# EAGLE design avr_servo (EAGLE 5.11)
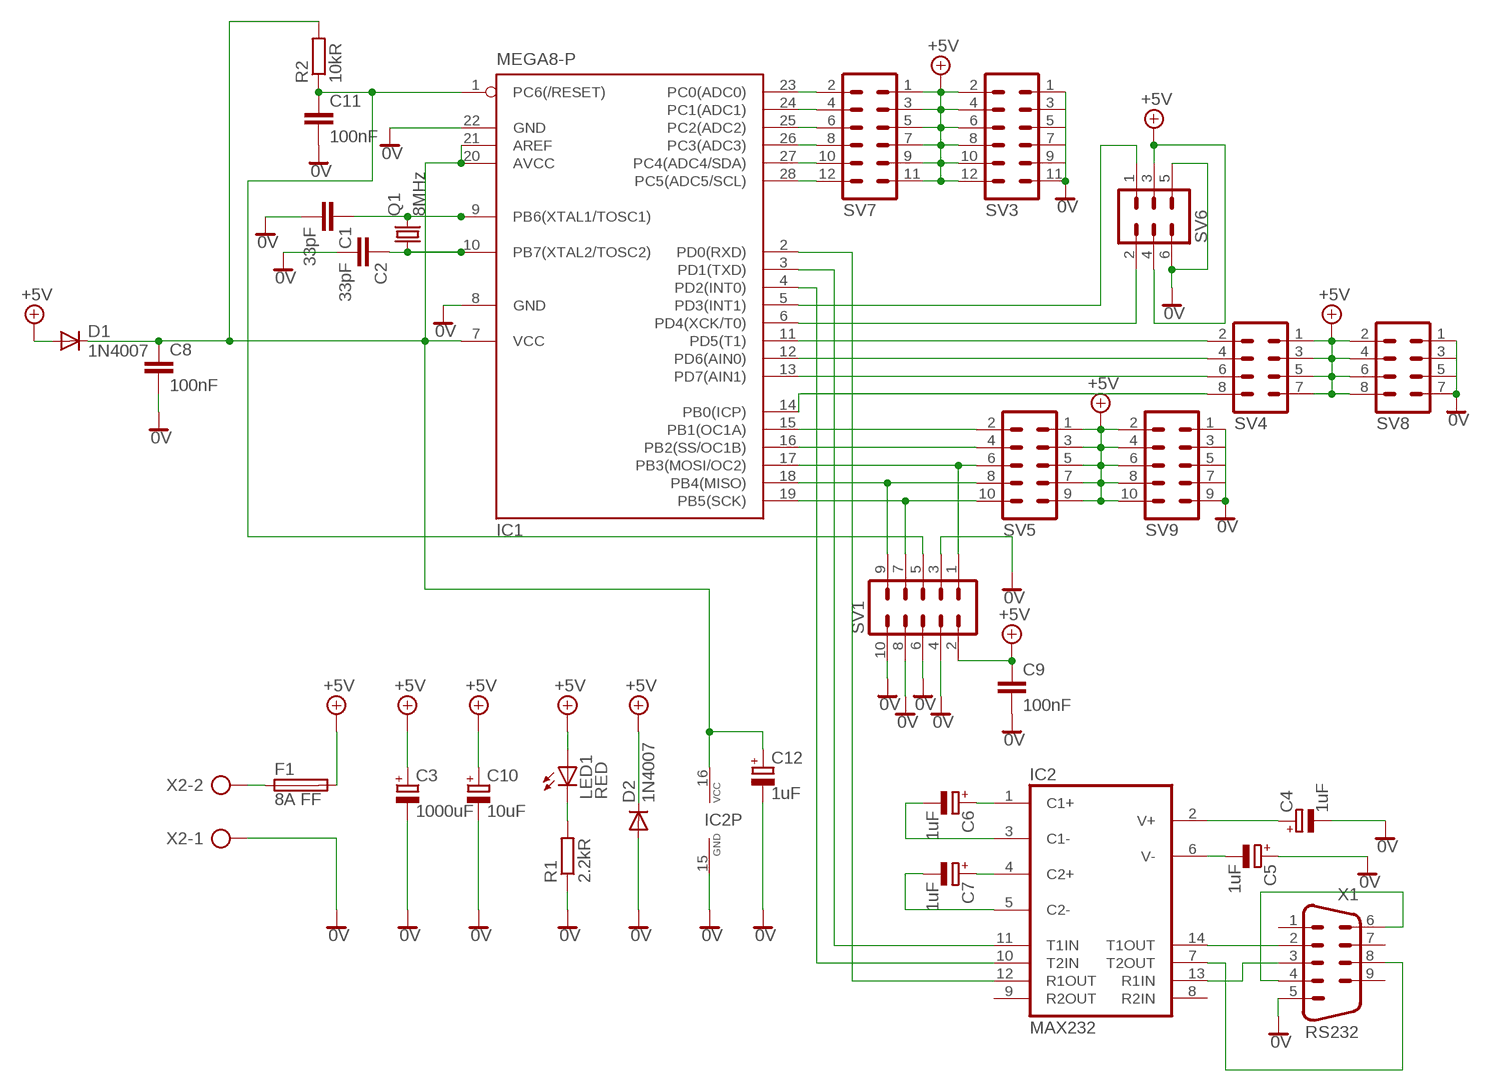
[diagram p0: schematic, sheet 1]

## Parts
C1  33pF  C-EU050-024X044  [C050-024X044]
C2  33pF  C-EU050-024X044  [C050-024X044]
C3  1000uF  CPOL-EUE3.5-10  [E3,5-10]
C4  1uF  CPOL-EUE2.5-5  [E2,5-5]
C5  1uF  CPOL-EUE2.5-5  [E2,5-5]
C6  1uF  CPOL-EUE2.5-5  [E2,5-5]
C7  1uF  CPOL-EUE2.5-5  [E2,5-5]
C8  100nF  C-EU050-025X075  [C050-025X075]
C9  100nF  C-EU050-025X075  [C050-025X075]
C10  10uF  CPOL-EUE2.5-5  [E2,5-5]
C11  100nF  C-EU050-025X075  [C050-025X075]
C12  1uF  CPOL-EUE2.5-5  [E2,5-5]
D1  1N4007  1N4446  [DO35-10]
D2  1N4007  1N4446  [DO35-10]
F1  8A FF  FUSESH22,5A  [SH22,5A]
IC1  MEGA8-P  [DIL28-3]
IC2  MAX232  [DIL16]
LED1  RED  LED5MM  [LED5MM]
Q1  8MHz  CRYSTALHC49S  [HC49/S]
R1  2.2kR  R-EU_0204/7  [0204/7]
R2  10kR  R-EU_0204/7  [0204/7]
SV1  ML10  [ML10]
SV3  MA06-2  [MA06-2]
SV4  MA04-2  [MA04-2]
SV5  MA05-2  [MA05-2]
SV6  MA03-2  [MA03-2]
SV7  MA06-2  [MA06-2]
SV8  MA04-2  [MA04-2]
SV9  MA05-2  [MA05-2]
X1  RS232  M09HP  [M09HP]
X2  AK300/2  [AK300/2]

## Nets
0V: C1.2 C2.2 C3.- C4.- C5.+ C8.2 C9.2 C10.- C11.2 C12.- D2.A IC1.8(GND) IC1.22(GND) IC2.15(GND) R1.1 SV1.3 SV1.4 SV1.6 SV1.8 SV1.10 SV3.1 SV3.3 SV3.5 SV3.7 SV3.9 SV3.11 SV6.5 SV6.6 SV8.1 SV8.3 SV8.5 SV8.7 SV9.1 SV9.3 SV9.5 SV9.7 SV9.9 X1.5 X2.1
+5V: C3.+ C9.1 C10.+ D1.A D2.C F1.2 LED1.A SV1.2 SV3.2 SV3.4 SV3.6 SV3.8 SV3.10 SV3.12 SV4.1 SV4.3 SV4.5 SV4.7 SV5.1 SV5.3 SV5.5 SV5.7 SV5.9 SV6.3 SV6.4 SV7.1 SV7.3 SV7.5 SV7.7 SV7.9 SV7.11 SV8.2 SV8.4 SV8.6 SV8.8 SV9.2 SV9.4 SV9.6 SV9.8 SV9.10
N$1: IC2.14(T1OUT) X1.2
N$2: IC2.13(R1IN) X1.3
N$3: X1.4 X1.6
N$4: IC2.7(T2OUT) X1.8
N$5: C5.- IC2.6(V-)
N$6: C4.+ IC2.2(V+)
N$7: C6.+ IC2.1(C1+)
N$8: C7.+ IC2.4(C2+)
N$9: C6.- IC2.3(C1-)
N$10: C7.- IC2.5(C2-)
N$11: C8.1 C12.+ D1.C IC1.7(VCC) IC1.20(AVCC) IC1.21(AREF) IC2.16(VCC) R2.2
N$12: IC1.4(PD2(INT0)) IC2.10(T2IN)
N$13: C1.1 IC1.9(PB6(XTAL1/TOSC1)) Q1.2
N$14: C2.1 IC1.10(PB7(XTAL2/TOSC2)) Q1.1
N$15: F1.1 X2.2
N$17: C11.1 IC1.1(PC6(/RESET)) R2.1 SV1.5
N$18: IC1.5(PD3(INT1)) SV6.1
N$20: IC1.2(PD0(RXD)) IC2.12(R1OUT)
N$21: LED1.K(C) R1.2
N$22: IC1.3(PD1(TXD)) IC2.11(T1IN)
N$25: IC1.6(PD4(XCK/T0)) SV6.2
N$26: IC1.11(PD5(T1)) SV4.2
N$27: IC1.12(PD6(AIN0)) SV4.4
N$28: IC1.13(PD7(AIN1)) SV4.6
N$30: IC1.14(PB0(ICP)) SV4.8
N$31: IC1.15(PB1(OC1A)) SV5.2
N$32: IC1.16(PB2(SS/OC1B)) SV5.4
N$33: IC1.17(PB3(MOSI/OC2)) SV1.1 SV5.6
N$35: IC1.18(PB4(MISO)) SV1.9 SV5.8
N$36: IC1.19(PB5(SCK)) SV1.7 SV5.10
N$37: IC1.23(PC0(ADC0)) SV7.2
N$38: IC1.24(PC1(ADC1)) SV7.4
N$39: IC1.25(PC2(ADC2)) SV7.6
N$40: IC1.26(PC3(ADC3)) SV7.8
N$41: IC1.27(PC4(ADC4/SDA)) SV7.10
N$42: IC1.28(PC5(ADC5/SCL)) SV7.12
Unconnected: IC2.8(R2IN) IC2.9(R2OUT) X1.1 X1.7 X1.9

## Library data of the parts
C1 C2 C8 C9 C11 = rcl:C-EU: CAPACITOR, European symbol
C3-C7 C10 C12 = rcl:CPOL-EU: POLARIZED CAPACITOR, European symbol
D1 D2 = diode:1N4446: DIODE high speed (Philips)
F1 = fuse:FUSE: Fuse
IC1 = atmel:MEGA8-P: MICROCONTROLLER 8 Kbytes FLASH, 1 kbytes SRAM, 512 bytes EEPROM, USART, 4-channel 10 bit ADC, 2-channel 8 bit ADC Pin compatible with Atmega48, ATMega88, ATMega168 Source: avr.lbr; OC_FARNELL: unknown; OC_NEWARK: unknown
IC2 = maxim:MAX232: RS232 TRANSEIVER
LED1 = led:LED: LED OSRAM: - CHIPLED LG R971, LG N971, LY N971, LG Q971, LY Q971, LO R971, LY R971 LH N974, LH R974 LS Q976, LO Q976, LY Q976 LO Q996 - Hyper CHIPLED LW Q18S LB Q993, LB Q99A, LB R99A - SideLED LS A670, LO A670, LY A670, LG A670, LP A670 LB A673, LV A673, LT A673, LW A673 LH A674 LY A675 LS A676, LA A676, LO A676, LY A676, LW A676 LS A679, LY A679, LG A679 - Hyper Micro SIDELED® LS Y876, LA Y876, LO Y876, LY Y876 LT Y87S - SmartLED LW L88C, LW L88S LB L89C, LB L89S, LG L890 LS L89K, LO L89K, LY L89K LS L896, LA L896, LO L896, LY L896 - TOPLED LS T670, LO T670, LY T670, LG T670, LP T670 LSG T670, LSP T670, LSY T670, LOP T670, LYG T670 LG T671, LOG T671, LSG T671 LB T673, LV T673, LT T673, LW T673 LH T674 LS T676, LA T676, LO T676, LY T676, LB T676, LH T676, LSB T676, LW T676 LB T67C, LV T67C, LT T67C, LS T67K, LO T67K, LY T67K, LW E67C LS E67B, LA E67B, LO E67B, LY E67B, LB E67C, LV E67C, LT E67C LW T67C LS T679, LY T679, LG T679 LS T770, LO T770, LY T770, LG T770, LP T770 LB T773, LV T773, LT T773, LW T773 LH T774 LS E675, LA E675, LY E675, LS T675 LS T776, LA T776, LO T776, LY T776, LB T776 LHGB T686 LT T68C, LB T68C - Hyper Mini TOPLED® LB M676 - Mini TOPLED Santana® LG M470 LS M47K, LO M47K, LY M47K Source: http://www.osram.convergy.de LUXEON: - LUMILED® LXK2-PW12-R00, LXK2-PW12-S00, LXK2-PW14-U00, LXK2-PW14-V00 LXK2-PM12-R00, LXK2-PM12-S00, LXK2-PM14-U00 LXK2-PE12-Q00, LXK2-PE12-R00, LXK2-PE12-S00, LXK2-PE14-T00, LXK2-PE14-U00 LXK2-PB12-K00, LXK2-PB12-L00, LXK2-PB12-M00, LXK2-PB14-N00, LXK2-PB14-P00, LXK2-PB14-Q00 LXK2-PR12-L00, LXK2-PR12-M00, LXK2-PR14-Q00, LXK2-PR14-R00 LXK2-PD12-Q00, LXK2-PD12-R00, LXK2-PD12-S00 LXK2-PH12-R00, LXK2-PH12-S00 LXK2-PL12-P00, LXK2-PL12-Q00, LXK2-PL12-R00 Source: www.luxeon.com KINGBRIGHT: KA-3528ASYC Source: www.kingbright.com
Q1 = crystal:CRYSTAL: CRYSTAL
R1 R2 = rcl:R-EU_: RESISTOR, European symbol
SV1 = con-harting-ml:ML10: HARTING; OC_FARNELL: unknown; OC_NEWARK: unknown
SV3 SV7 = con-lstb:MA06-2: PIN HEADER; OC_FARNELL: unknown; OC_NEWARK: unknown
SV4 SV8 = con-lstb:MA04-2: PIN HEADER; OC_FARNELL: unknown; OC_NEWARK: unknown
SV5 SV9 = con-lstb:MA05-2: PIN HEADER; OC_FARNELL: unknown; OC_NEWARK: unknown
SV6 = con-lstb:MA03-2: PIN HEADER; OC_FARNELL: unknown; OC_NEWARK: unknown
X1 = con-subd:M09: SUB-D
X2 = con-ptr500:AK300/2: CONNECTOR

## Board
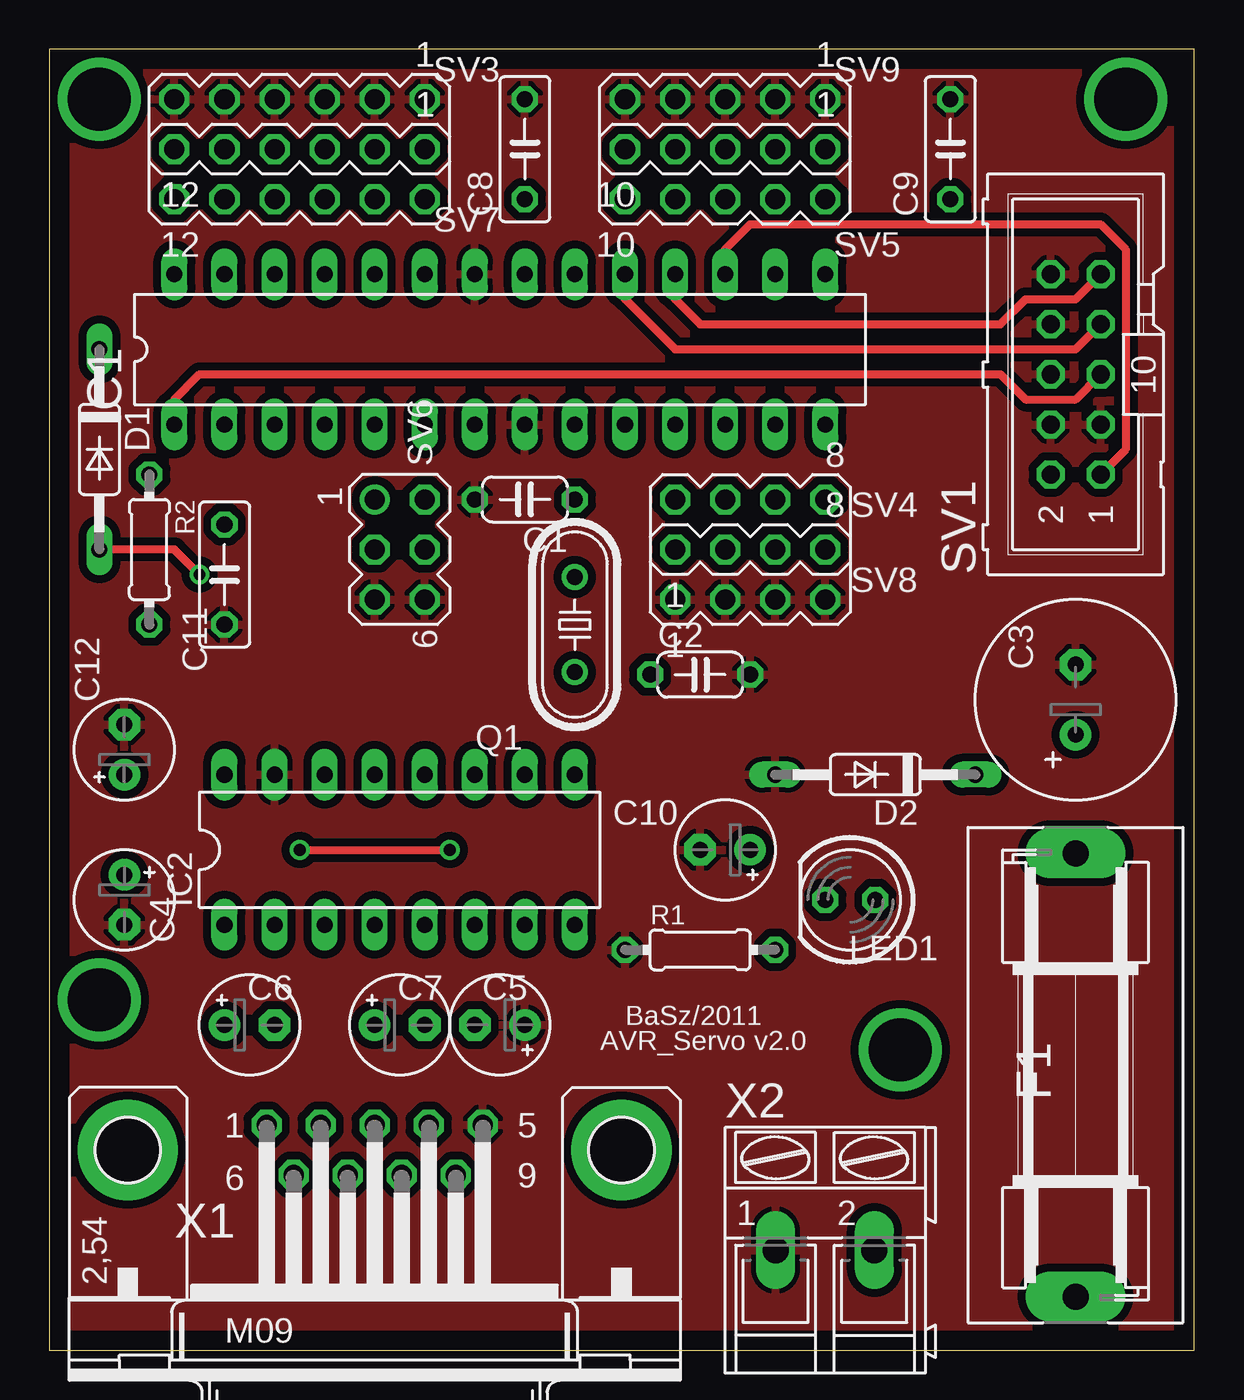
[diagram p1: board, top side]
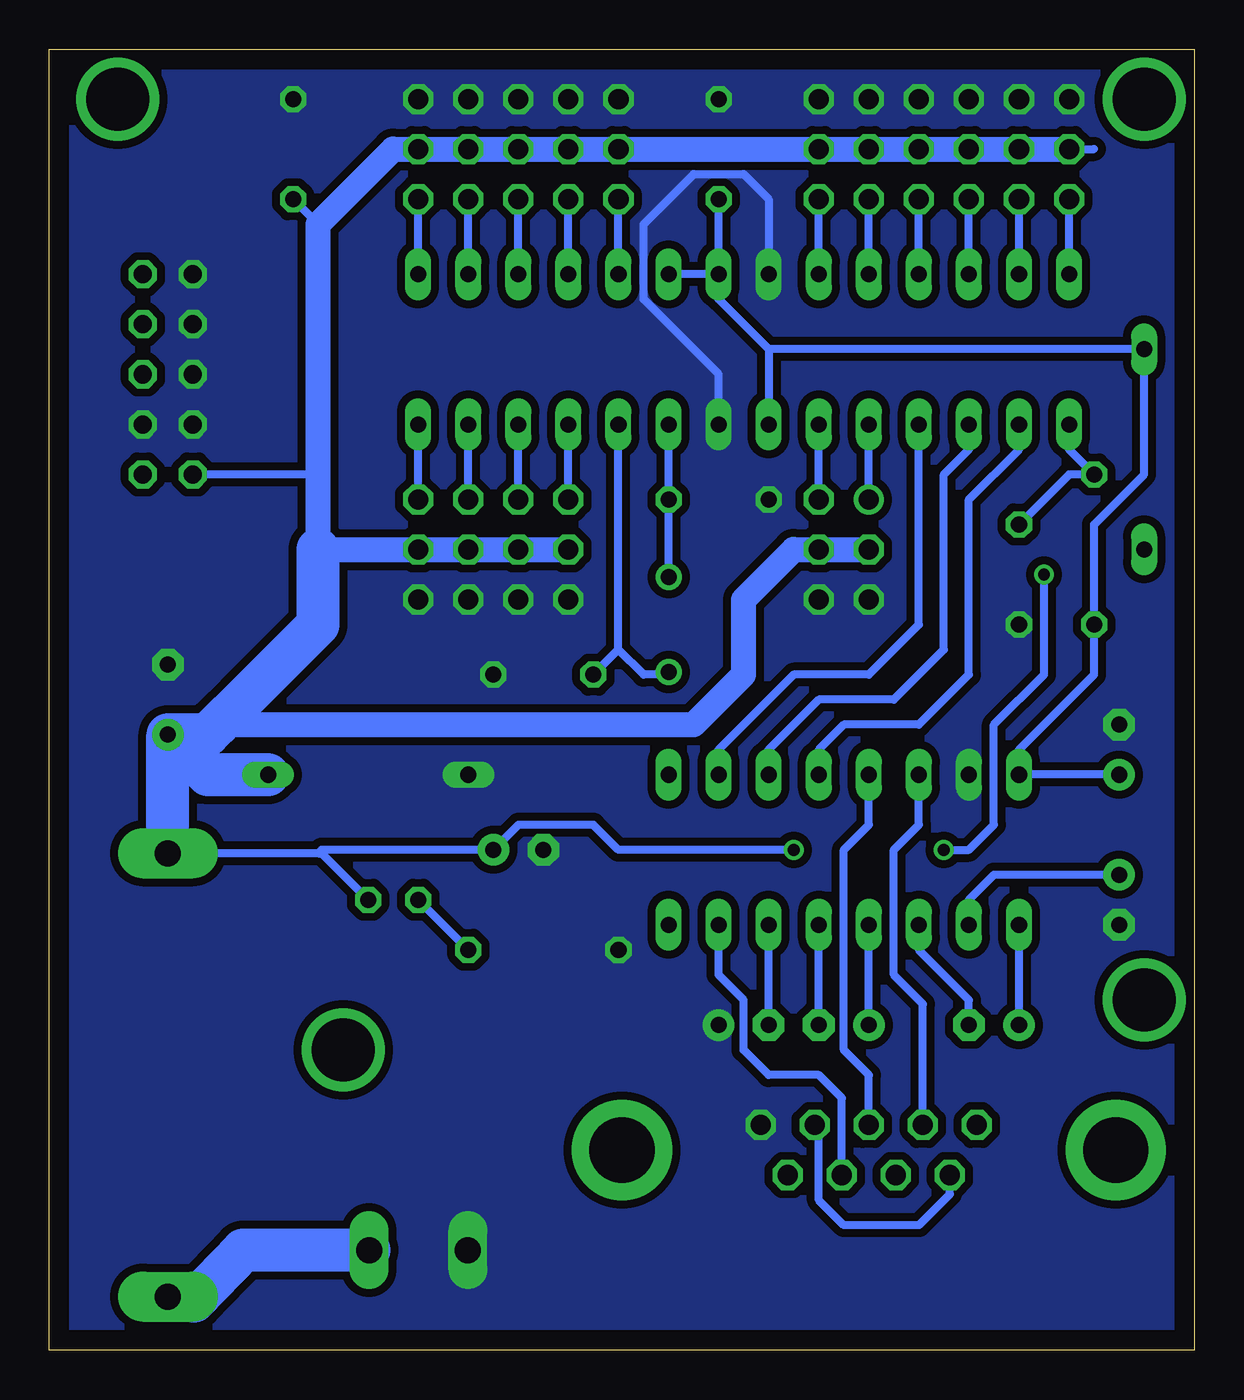
[diagram p2: board, bottom side, seen from below]

Size 58.09 x 66.03 mm. Coordinates in mm from the lower left corner, seen from the top.
Outline: 0,0 58.09,0 58.09,66.03 0,66.03 0,0
Copper layers (1*16): Top 0.035mm / dielectric 1.5mm / Bottom 0.035mm
Design rules "default": minimum track width 10mil, minimum drill 24mil, track to track 8mil, track to pad 8mil, pad to pad 8mil, via to via 8mil, smd to smd 8mil, copper to edge 40mil, drill to drill 8mil, minimum pad ring 10mil, minimum via ring 8mil, stop-mask expansion 4mil, vias tented up to drill 0mil, thermal gap 10mil

### Footprints (pad centres in the part's own frame; a part is rotated, then mirrored left to right if it is on the bottom)
C050-024X044 = drill 0.813 octagon: 1 -2.54,0; 2 2.54,0
E3,5-10 = drill 0.813 pad 1.6 round: + -1.778,0 | drill 0.813 pad 1.6 octagon: - 1.778,0
E2,5-5 = drill 0.813 pad 1.6 round: + -1.27,0 | drill 0.813 pad 1.6 octagon: - 1.27,0
C050-025X075 = drill 0.813 octagon: 1 -2.54,0; 2 2.54,0
DO35-10 = drill 0.813 long: A 5.08,0; C -5.08,0
SH22,5A = drill 1.321 pad 2.54 long: 1 -11.252,0; 2 11.252,0
DIL28-3 = drill 0.813 long: 1 -16.51,-3.81; 2 -13.97,-3.81; 3 -11.43,-3.81; 4 -8.89,-3.81; 5 -6.35,-3.81; 6 -3.81,-3.81; 7 -1.27,-3.81; 8 1.27,-3.81; 9 3.81,-3.81; 10 6.35,-3.81; 11 8.89,-3.81; 12 11.43,-3.81; 13 13.97,-3.81; 14 16.51,-3.81; 15 16.51,3.81; 16 13.97,3.81; 17 11.43,3.81; 18 8.89,3.81; 19 6.35,3.81; 20 3.81,3.81; 21 1.27,3.81; 22 -1.27,3.81; 23 -3.81,3.81; 24 -6.35,3.81; 25 -8.89,3.81; 26 -11.43,3.81; 27 -13.97,3.81; 28 -16.51,3.81
DIL16 = drill 0.813 long: 1 -8.89,-3.81; 2 -6.35,-3.81; 3 -3.81,-3.81; 4 -1.27,-3.81; 5 1.27,-3.81; 6 3.81,-3.81; 7 6.35,-3.81; 8 8.89,-3.81; 9 8.89,3.81; 10 6.35,3.81; 11 3.81,3.81; 12 1.27,3.81; 13 -1.27,3.81; 14 -3.81,3.81; 15 -6.35,3.81; 16 -8.89,3.81
LED5MM = drill 0.813 octagon: A -1.27,0; K 1.27,0
HC49/S = drill 0.813 round: 1 -2.413,0; 2 2.413,0
0204/7 = drill 0.813 octagon: 1 -3.81,0; 2 3.81,0
ML10 = drill 0.914 octagon: 1 -5.08,-1.27; 2 -5.08,1.27; 3 -2.54,-1.27; 4 -2.54,1.27; 5 0,-1.27; 6 0,1.27; 7 2.54,-1.27; 8 2.54,1.27; 9 5.08,-1.27; 10 5.08,1.27
MA06-2 = drill 1.016 octagon: 1 -6.35,-1.27; 2 -6.35,1.27; 3 -3.81,-1.27; 4 -3.81,1.27; 5 -1.27,-1.27; 6 -1.27,1.27; 7 1.27,-1.27; 8 1.27,1.27; 9 3.81,-1.27; 10 3.81,1.27; 11 6.35,-1.27; 12 6.35,1.27
MA04-2 = drill 1.016 octagon: 1 -3.81,-1.27; 2 -3.81,1.27; 3 -1.27,-1.27; 4 -1.27,1.27; 5 1.27,-1.27; 6 1.27,1.27; 7 3.81,-1.27; 8 3.81,1.27
MA05-2 = drill 1.016 octagon: 1 -5.08,-1.27; 2 -5.08,1.27; 3 -2.54,-1.27; 4 -2.54,1.27; 5 0,-1.27; 6 0,1.27; 7 2.54,-1.27; 8 2.54,1.27; 9 5.08,-1.27; 10 5.08,1.27
MA03-2 = drill 1.016 round: 1 -2.54,-1.27 | drill 1.016 octagon: 2 -2.54,1.27; 3 0,-1.27; 4 0,1.27; 5 2.54,-1.27; 6 2.54,1.27
M09HP = drill 1.016 octagon: 1 -5.486,1.27; 2 -2.743,1.27; 3 0,1.27; 4 2.743,1.27; 5 5.486,1.27; 6 -4.115,-1.27; 7 -1.372,-1.27; 8 1.372,-1.27; 9 4.115,-1.27 | drill 3.302 pad 5.08 round: G1 -12.522,0; G2 12.522,0
AK300/2 = drill 1.321 long: 1 -2.515,0; 2 2.489,0

### Placement (x,y rotation side)
C1  24.13,43.18 180 top
C2  33.02,34.29 0 top
C3  52.07,33.02 90 top
C4  3.81,22.86 270 top
C5  22.86,16.51 180 top
C6  10.16,16.51 0 top
C7  17.78,16.51 0 top
C8  24.13,60.96 90 top
C9  45.72,60.96 90 top
C10  34.29,25.4 180 top
C11  8.89,39.37 270 top
C12  3.81,30.48 90 top
D1  2.54,45.72 270 top
D2  41.91,29.21 180 top
F1  52.07,13.97 90 top
IC1  22.86,50.8 0 top
IC2  17.78,25.4 0 top
LED1  40.64,22.86 180 top
Q1  26.67,36.83 90 top
R1  33.02,20.32 0 top
R2  5.08,40.64 270 top
SV1  52.07,49.53 90 top
SV3  12.7,62.23 180 top
SV4  35.56,41.91 0 top
SV5  34.29,59.69 180 top
SV6  17.78,40.64 270 top
SV7  12.7,59.69 180 top
SV8  35.56,39.37 0 top
SV9  34.29,62.23 180 top
X1  16.51,10.16 0 top
X2  39.37,5.08 0 top

### Tracks (layer width: path | path; a pad name or v marks a point on that pad's centre or on a via)
0V
  Bottom 0.406: X1.5 22,11.84 | IC1.22 21.59,58.42 22.86,59.69 25.4,59.69 27.94,57.15 27.94,53.34 24.13,49.53 IC1.8
  pour Bottom (isolate 0.406, no thermals): 0,0 58.42,0 58.42,66.04 0,66.04
  pour Top (isolate 0.406): 0,0 58.42,0 58.42,66.04 0,66.04
+5V  (via drill 0.6)
  Top 0.406: D1.A 6.35,40.64 v7.62,39.37 | v12.7,25.4 v20.32,25.4
  Bottom 0.406: SV3.12 5.08,60.96 | 44.45,44.45 SV1.2 | 43.81,57.78 44.45,57.15 C9.1 | 44.45,25.22 F1.2 | 44.45,25.22 44.27,25.22 LED1.A | 44.45,25.22 44.27,25.4 C10.+ 34.29,26.67 30.48,26.67 29.21,25.4 v20.32,25.4 | v7.62,39.37 7.62,34.29 10.16,31.75 10.16,26.67 11.43,25.4 v12.7,25.4
  Bottom 1.27: SV3.12 SV3.10 SV3.8 SV3.6 SV3.4 SV3.2 SV9.10 SV9.8 SV9.6 SV9.4 SV9.2 40.64,60.96 44.45,57.15 44.45,44.45 44.45,40.64 SV8.8 SV8.6 SV8.4 SV8.2 | 49.53,31.75 25.4,31.75 22.86,34.29 22.86,38.1 20.32,40.64 SV6.4 SV6.3
  Bottom 2.184: F1.2 C3.+ | C3.+ 50.04,31.24 49.53,31.75 48.26,33.02 44.45,36.83 44.45,40.64 | D2.C 50.04,29.21 C3.+
N$1
  Bottom 0.406: X1.2 13.77,17.58 15.24,19.05 15.24,25.4 13.97,26.67 IC2.14
N$2
  Bottom 0.406: X1.3 16.51,13.97 17.78,15.24 17.78,25.4 16.51,26.67 IC2.13
N$3
  Bottom 0.406: X1.6 12.39,7.93 13.97,6.35 17.78,6.35 19.05,7.62 19.05,11.23 X1.4
N$4
  Bottom 0.406: X1.8 17.88,12.8 19.05,13.97 21.59,13.97 22.86,15.24 22.86,17.78 24.13,19.05 IC2.7
N$5
  Bottom 0.406: C5.- IC2.6
N$6
  Bottom 0.406: IC2.2 11.43,22.86 10.16,24.13 C4.+
N$7
  Bottom 0.406: C6.+ IC2.1
N$8
  Bottom 0.406: C7.+ IC2.4
N$9
  Bottom 0.406: IC2.3 13.97,20.32 11.43,17.78 C6.-
N$10
  Bottom 0.406: C7.- IC2.5
N$11
  Bottom 0.406: IC1.21 C8.1 | IC1.21 IC1.20 | 21.59,50.8 IC1.7 | IC1.21 24.13,53.34 21.59,50.8 | C12.+ IC2.16 8.89,30.48 5.08,34.29 R2.2 5.08,41.91 2.54,44.45 D1.C 21.59,50.8
N$12
  Bottom 0.406: IC1.4 13.97,36.83 16.51,34.29 20.32,34.29 24.13,30.48 IC2.10
N$13
  Bottom 0.406: Q1.2 C1.1 IC1.9
N$14
  Bottom 0.406: 29.21,35.56 IC1.10 | 29.21,35.56 27.94,34.29 26.8,34.29 Q1.1 | 29.21,35.56 C2.1
N$15
  Bottom 0.406: 52.02,2.67 F1.1
  Bottom 2.184: X2.2 48.26,5.08 50.75,2.49 52.02,2.67
N$16  (via drill 3.2 pad 2.54)
  other vias: 2.54,63.5
N$17
  Top 0.406: IC1.1 6.35,48.26 7.62,49.53 48.26,49.53 49.53,48.26 52.07,48.26 SV1.5
  Bottom 0.406: IC1.1 6.35,45.72 R2.1 6.35,44.45 C11.1
N$18
  Bottom 0.406: SV6.1 IC1.5
N$19  (via drill 3.2 pad 2.54)
  other vias: 43.18,15.24
N$20
  Bottom 0.406: IC1.2 8.89,45.72 11.43,43.18 11.43,34.29 13.97,31.75 17.78,31.75 19.05,30.48 IC2.12
N$21
  Bottom 0.406: R1.2 LED1.K
N$22
  Bottom 0.406: IC1.3 11.43,45.72 12.7,44.45 12.7,35.56 15.24,33.02 19.05,33.02 21.59,30.48 IC2.11
N$23  (via drill 3.2 pad 2.54)
  other vias: 54.61,63.5
N$24  (via drill 3.2 pad 2.54)
  other vias: 2.54,17.78
N$25
  Bottom 0.406: SV6.2 IC1.6
N$26
  Bottom 0.406: SV4.2 IC1.11
N$27
  Bottom 0.406: SV4.4 IC1.12
N$28
  Bottom 0.406: SV4.6 IC1.13
N$30
  Bottom 0.406: SV4.8 IC1.14
N$31
  Bottom 0.406: IC1.15 SV5.2
N$32
  Bottom 0.406: IC1.16 SV5.4
N$33
  Top 0.406: IC1.17 34.29,55.88 35.56,57.15 53.34,57.15 54.61,55.88 54.61,45.72 SV1.1
  Bottom 0.406: IC1.17 SV5.6
N$35
  Top 0.406: SV1.9 52.07,53.34 49.53,53.34 48.26,52.07 33.02,52.07 31.75,53.34 IC1.18
  Bottom 0.406: IC1.18 SV5.8
N$36
  Top 0.406: SV1.7 52.07,50.8 31.75,50.8 29.21,53.34 IC1.19
  Bottom 0.406: IC1.19 SV5.10
N$37
  Bottom 0.406: IC1.23 SV7.2
N$38
  Bottom 0.406: IC1.24 SV7.4
N$39
  Bottom 0.406: IC1.25 SV7.6
N$40
  Bottom 0.406: IC1.26 SV7.8
N$41
  Bottom 0.406: IC1.27 SV7.10
N$42
  Bottom 0.406: IC1.28 SV7.12

### Text on the board
tNames: BaSz/2011 | AVR_Servo v2.0